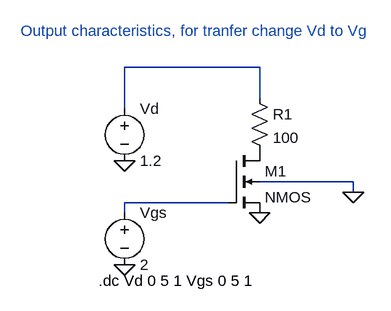
[diagram p0: schematic 2_Id.asc]
2_Id.asc, the LTspice schematic file:
Version 4.1
SHEET 1 1456 680
WIRE 288 16 80 16
WIRE 288 64 288 16
WIRE 80 80 80 16
WIRE 432 192 288 192
WIRE 432 208 432 192
WIRE 240 224 80 224
WIRE 80 240 80 224
FLAG 80 160 0
FLAG 80 320 0
FLAG 288 240 0
FLAG 432 208 0
SYMBOL nmos4 240 144 R0
SYMATTR InstName M1
SYMBOL voltage 80 224 R0
WINDOW 123 0 0 Left 0
WINDOW 39 0 0 Left 0
SYMATTR InstName Vgs
SYMATTR Value 2
SYMBOL res 272 48 R0
SYMATTR InstName R1
SYMATTR Value 100
SYMBOL voltage 80 64 R0
WINDOW 123 0 0 Left 0
WINDOW 39 0 0 Left 0
SYMATTR InstName Vd
SYMATTR Value 1.2
TEXT 40 344 Left 2 !.dc Vd 0 5 1 Vgs 0 5 1
TEXT -80 -40 Left 2 ;Output characteristics, for tranfer change Vd to Vg

The netlist it stands for:
* 2_Id.asc
M1 P001 N002 0 0 NMOS
Vgs N002 0 2
R1 N001 P001 100
Vd N001 0 1.2
.model NMOS NMOS
.model PMOS PMOS
.lib standard.mos
.dc Vd 0 5 1 Vgs 0 5 1
* Output characteristics, for tranfer change Vd to Vg
.backanno
.end